# Altium schematic sheet Carte_Alim_2019_CAP.SchDoc
size A4; Author: Audran; CompanyName: Goldorak; Address1: Electrolab; Address2: 52 rue Paul Lescop; Address3: 92000 Nanterre; DocumentNumber: 4; SheetNumber: 4; SheetTotal: 5; ProjectName: Cartes_2017
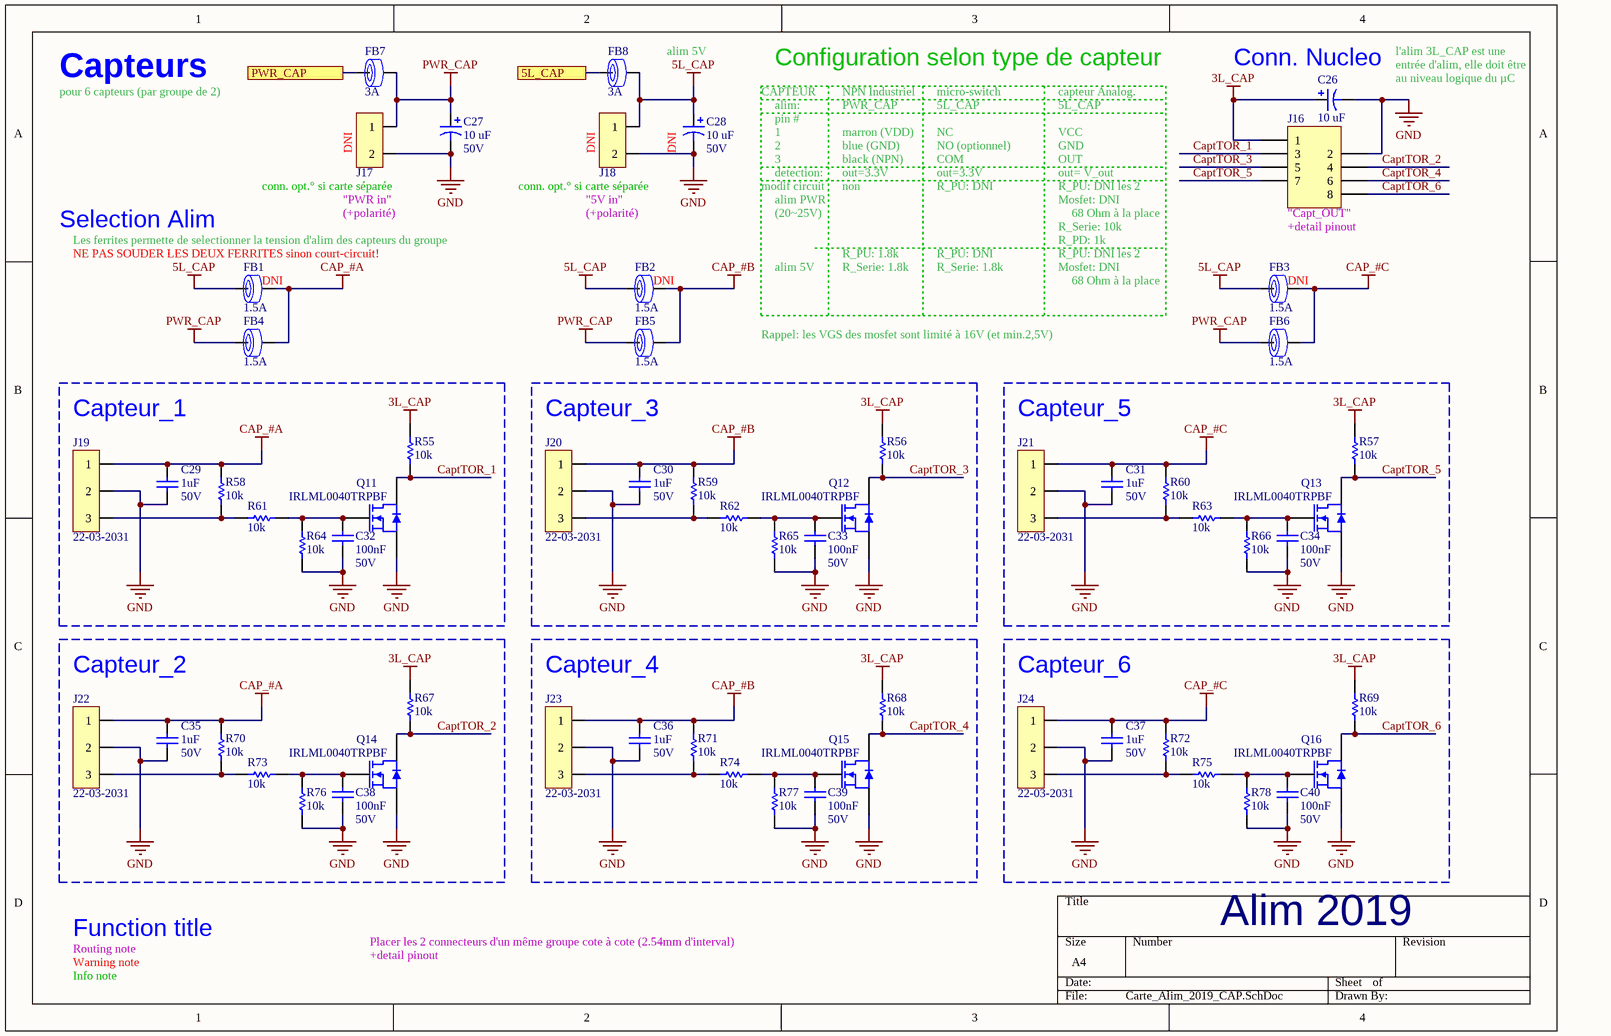
[diagram p0: Carte_Alim_2019_CAP.SchDoc]

## Parts
C26  10 uF  [WCAP-ATG8_5x11x2x0.5]
C27  10 uF  RatedVoltage: 50V  [WCAP-ATG8_5x11x2x0.5]
C28  10 uF  RatedVoltage: 50V  [WCAP-ATG8_5x11x2x0.5]
C29  1uF  RatedVoltage: 50V  [WCAP-CSGP_0805, 2x1.25x1.25]
C30  1uF  RatedVoltage: 50V  [WCAP-CSGP_0805, 2x1.25x1.25]
C31  1uF  RatedVoltage: 50V  [WCAP-CSGP_0805, 2x1.25x1.25]
C32  100nF  RatedVoltage: 50V  [WCAP-CSGP_0603, 1.6x0.8x0.8]
C33  100nF  RatedVoltage: 50V  [WCAP-CSGP_0603, 1.6x0.8x0.8]
C34  100nF  RatedVoltage: 50V  [WCAP-CSGP_0603, 1.6x0.8x0.8]
C35  1uF  RatedVoltage: 50V  [WCAP-CSGP_0805, 2x1.25x1.25]
C36  1uF  RatedVoltage: 50V  [WCAP-CSGP_0805, 2x1.25x1.25]
C37  1uF  RatedVoltage: 50V  [WCAP-CSGP_0805, 2x1.25x1.25]
C38  100nF  RatedVoltage: 50V  [WCAP-CSGP_0603, 1.6x0.8x0.8]
C39  100nF  RatedVoltage: 50V  [WCAP-CSGP_0603, 1.6x0.8x0.8]
C40  100nF  RatedVoltage: 50V  [WCAP-CSGP_0603, 1.6x0.8x0.8]
FB1  RatedCurrent: 1.5A  [WE-CBF_0603_High Current]  (hidden comment: 742792624)
FB2  RatedCurrent: 1.5A  [WE-CBF_0603_High Current]  (hidden comment: 742792624)
FB3  RatedCurrent: 1.5A  [WE-CBF_0603_High Current]  (hidden comment: 742792624)
FB4  RatedCurrent: 1.5A  [WE-CBF_0603_High Current]  (hidden comment: 742792624)
FB5  RatedCurrent: 1.5A  [WE-CBF_0603_High Current]  (hidden comment: 742792624)
FB6  RatedCurrent: 1.5A  [WE-CBF_0603_High Current]  (hidden comment: 742792624)
FB7  RatedCurrent: 3A  [WE-CBF_0805_High Current]  (hidden comment: 742792023)
FB8  RatedCurrent: 3A  [WE-CBF_0805_High Current]  (hidden comment: 742792023)
J16  690367280876  [690367280876]  (value not drawn)
J17  22-03-2021  [22-03-2021]  (value not drawn)
J18  22-03-2021  [22-03-2021]  (value not drawn)
J19  22-03-2031  [22-03-2031]
J20  22-03-2031  [22-03-2031]
J21  22-03-2031  [22-03-2031]
J22  22-03-2031  [22-03-2031]
J23  22-03-2031  [22-03-2031]
J24  22-03-2031  [22-03-2031]
Q11  IRLML0040TRPBF  [SOT-23]
Q12  IRLML0040TRPBF  [SOT-23]
Q13  IRLML0040TRPBF  [SOT-23]
Q14  IRLML0040TRPBF  [SOT-23]
Q15  IRLML0040TRPBF  [SOT-23]
Q16  IRLML0040TRPBF  [SOT-23]
R55  value 10k  [RESC1608X06N]  (hidden comment: RC0603FR-0710KL)
R56  value 10k  [RESC1608X06N]  (hidden comment: RC0603FR-0710KL)
R57  value 10k  [RESC1608X06N]  (hidden comment: RC0603FR-0710KL)
R58  value 10k  [RESC1608X06N]  (hidden comment: RC0603FR-0710KL)
R59  value 10k  [RESC1608X06N]  (hidden comment: RC0603FR-0710KL)
R60  value 10k  [RESC1608X06N]  (hidden comment: RC0603FR-0710KL)
R61  value 10k  [RESC1608X06N]  (hidden comment: RC0603FR-0710KL)
R62  value 10k  [RESC1608X06N]  (hidden comment: RC0603FR-0710KL)
R63  value 10k  [RESC1608X06N]  (hidden comment: RC0603FR-0710KL)
R64  value 10k  [RESC1608X06N]  (hidden comment: RC0603FR-0710KL)
R65  value 10k  [RESC1608X06N]  (hidden comment: RC0603FR-0710KL)
R66  value 10k  [RESC1608X06N]  (hidden comment: RC0603FR-0710KL)
R67  value 10k  [RESC1608X06N]  (hidden comment: RC0603FR-0710KL)
R68  value 10k  [RESC1608X06N]  (hidden comment: RC0603FR-0710KL)
R69  value 10k  [RESC1608X06N]  (hidden comment: RC0603FR-0710KL)
R70  value 10k  [RESC1608X06N]  (hidden comment: RC0603FR-0710KL)
R71  value 10k  [RESC1608X06N]  (hidden comment: RC0603FR-0710KL)
R72  value 10k  [RESC1608X06N]  (hidden comment: RC0603FR-0710KL)
R73  value 10k  [RESC1608X06N]  (hidden comment: RC0603FR-0710KL)
R74  value 10k  [RESC1608X06N]  (hidden comment: RC0603FR-0710KL)
R75  value 10k  [RESC1608X06N]  (hidden comment: RC0603FR-0710KL)
R76  value 10k  [RESC1608X06N]  (hidden comment: RC0603FR-0710KL)
R77  value 10k  [RESC1608X06N]  (hidden comment: RC0603FR-0710KL)
R78  value 10k  [RESC1608X06N]  (hidden comment: RC0603FR-0710KL)

## Blocks framed on the sheet
Capteur_1: C29 C32 J19 Q11 R55 R58 R61 R64
Capteur_3: C30 C33 J20 Q12 R56 R59 R62 R65
Capteur_5: C31 C34 J21 Q13 R57 R60 R63 R66
Capteur_2: C35 C38 J22 Q14 R67 R70 R73 R76
Capteur_4: C36 C39 J23 Q15 R68 R71 R74 R77
Capteur_6: C37 C40 J24 Q16 R69 R72 R75 R78

## Ports
5L_CAP, PWR_CAP

## Nets
3L_CAP: C26.1 J16.1 R55.2 R56.2 R57.2 R67.2 R68.2 R69.2
5L_CAP: C28.1 FB1.1 FB2.1 FB3.1 FB8.2 J18.1
CAP_#A: C29.2 C35.2 FB1.2 FB4.2 J19.1 J22.1 R58.2 R70.2
CAP_#B: C30.2 C36.2 FB2.2 FB5.2 J20.1 J23.1 R59.2 R71.2
CAP_#C: C31.2 C37.2 FB3.2 FB6.2 J21.1 J24.1 R60.2 R72.2
GND: C26.2 C27.2 C28.2 C29.1 C30.1 C31.1 C32.2 C33.2 C34.2 C35.1 C36.1 C37.1 C38.2 C39.2 C40.2 J16.2 J17.2 J18.2 J19.2 J20.2 J21.2 J22.2 J23.2 J24.2 Q11.2(S) Q12.2(S) Q13.2(S) Q14.2(S) Q15.2(S) Q16.2(S) R64.1 R65.1 R66.1 R76.1 R77.1 R78.1
PWR_CAP: C27.1 FB4.1 FB5.1 FB6.1 FB7.2 J17.1
5L_CAP: FB8.1 ; port 5L_CAP  [a separate net that carries the same name]
CaptTOR_1: J16.3 Q11.3(D) R55.1
CaptTOR_2: J16.4 Q14.3(D) R67.1
CaptTOR_3: J16.5 Q12.3(D) R56.1
CaptTOR_4: J16.6 Q15.3(D) R68.1
CaptTOR_5: J16.7 Q13.3(D) R57.1
CaptTOR_6: J16.8 Q16.3(D) R69.1
PWR_CAP: FB7.1 ; port PWR_CAP  [a separate net that carries the same name]
NetC32_1: C32.1 Q11.1(G) R61.2 R64.2
NetC33_1: C33.1 Q12.1(G) R62.2 R65.2
NetC34_1: C34.1 Q13.1(G) R63.2 R66.2
NetC38_1: C38.1 Q14.1(G) R73.2 R76.2
NetC39_1: C39.1 Q15.1(G) R74.2 R77.2
NetC40_1: C40.1 Q16.1(G) R75.2 R78.2
NetJ19_3: J19.3 R58.1 R61.1
NetJ20_3: J20.3 R59.1 R62.1
NetJ21_3: J21.3 R60.1 R63.1
NetJ22_3: J22.3 R70.1 R73.1
NetJ23_3: J23.3 R71.1 R74.1
NetJ24_3: J24.3 R72.1 R75.1

## Notes on the sheet
- Capteurs
- pour 6 capteurs (par groupe de 2)
- alim 5V
- CAPTEUR
- alim:
- Configuration selon type de capteur
- NPN Industriel
- PWR_CAP
- micro-switch
- 5L_CAP
- capteur Analog.
- (near C26) Conn. Nucleo
- l'alim 3L_CAP est une
- au niveau logique du µC
- entrée d'alim, elle doit être
- (near J17) DNI
- (near J18) DNI
- (near C28) DNI
- pin #
- 1
- 2
- 3
- detection:
- marron (VDD)
- blue (GND)
- black (NPN)
- out=3.3V
- NC
- NO (optionnel)
- COM
- VCC
- OUT
- GND
- out= V_out
- Selection Alim
- (near FB1) Les ferrites permette de selectionner la tension d'alim des capteurs du groupe
- (near J17) conn. opt.° si carte séparée
- (near J17) "PWR in"
- (+polarité)
- conn. opt.° si carte séparée
- (near J18) "5V in"
- modif circuit
- alim PWR
- (20~25V)
- non
- R_PU: DNI
- R_PU: DNI les 2
- Mosfet: DNI
- R_Serie: 10k
- R_PD: 1k
- 68 Ohm à la place
- (near J16) "Capt_OUT"
- (near J16) +detail pinout
- (near FB1) NE PAS SOUDER LES DEUX FERRITES sinon court-circuit!
- (near FB1) DNI
- (near FB2) DNI
- R_PU: 1.8k
- R_Serie: 1.8k
- (near FB3) DNI
- Rappel: les VGS des mosfet sont limité à 16V (et min.2,5V)
- Routing note
- Warning note
- Info note
- Function title
- Placer les 2 connecteurs d'un même groupe cote à cote (2.54mm d'interval)
- +detail pinout
- Alim 2019

## Library data of the parts
C26 = WCAP-ATG8, 860010672009: CAP Alu 10 UF 20% 50 V; Manufacturer: Wurth Elektronik; RatedVoltage: 50V; PublishedDate: July 2016; ComponentLink1Description: Manufacturer; ComponentLink1URL: http://www.we-online.de; ComponentLink2Description: Datasheet; ComponentLink2URL: http://katalog.we-online.de/pbs/datasheet/860010672009.pdf; Value: 10 uF; Size: 5mmx11mm; Manufacturer Part Number: 860010672009
C27 C28 = WCAP-ATG8, 860010672009: CAP Alu 10 UF 20% 50 V; Manufacturer: Wurth Elektronik; PublishedDate: July 2016; ComponentLink1Description: Manufacturer; ComponentLink1URL: http://www.we-online.de; ComponentLink2Description: Datasheet; ComponentLink2URL: http://katalog.we-online.de/pbs/datasheet/860010672009.pdf; Value: 10 uF; Size: 5mmx11mm; Manufacturer Part Number: 860010672009
C29-C31 C35-C37 = WCAP-CSGP, 885012207103: CAP CER 1uF 50V X7R 0805; Manufacturer: Wurth Elektronik; PublishedDate: Aug 2016; ComponentLink1Description: Manufacturer; ComponentLink1URL: http://www.we-online.de; ComponentLink2Description: Datasheet; ComponentLink2URL: http://katalog.we-online.com/pbs/datasheet/885012207103.pdf; Manufacturer Part Number: 885012207103; Value: 1uF; Size: 0805; CeramicType: X7R
C32-C34 C38-C40 = WCAP-CSGP, 885012206095: CAP CER 100nF 50V X7R 0603; Manufacturer: Wurth Elektronik; PublishedDate: Aug 2016; ComponentLink1Description: Manufacturer; ComponentLink1URL: http://www.we-online.de; ComponentLink2Description: Datasheet; ComponentLink2URL: http://katalog.we-online.com/pbs/datasheet/885012206095.pdf; Value: 100nF; Size: 0603; CeramicType: X7R; Manufacturer Part Number: 885012206095
FB1-FB6 = WE-CBF, 742792624: Ferrite Bead 180ohm 0603 max1.5A; Manufacturer: Wurth Elektronik; Value: 180Ω; Type: High Current; PublishedDate: Aug 2016; ComponentLink1Description: Manufacturer; ComponentLink1URL: http://www.we-online.de; ComponentLink2Description: Datasheet; ComponentLink2URL: http://katalog.we-online.de/pbs/datasheet/742792624.pdf; Manufacturer Part Number: 742792624; Size: 0603
FB7 FB8 = WE-CBF, 742792023: Ferrite Bead 120ohm 0805 3A; Manufacturer: Wurth Elektronik; Value: 120Ω; ComponentLink1Description: Manufacturer; ComponentLink1URL: https://www.we-online.com/catalog/en/WE-CBF/?sq=742792023#742792023; ComponentLink2Description: Datasheet; ComponentLink2URL: https://www.we-online.com/catalog/datasheet/742792023.pdf; Manufacturer Part Number: 742792023; Supplier 2: JLCPCB; Supplier Part Number 2: C1015; Supplier 1: Farnell; Supplier Part Number 1: 1635732
J16 = 690367280876: WR-MM 8p Female SMT Connector with Polarization; Manufacturer: Wurth Electronics Inc.; Value: 8; Manufacturer Part Number: 690367280876; ComponentLink1Description: Datasheet; ComponentLink1URL: http://katalog.we-online.de/em/datasheet/69036728xx76.pdf; Supplier 1: Farnell; Supplier Part Number 1: 1641850
J17 J18 = 22-03-2021: Manufacturer 1: MOLEX; Supplier 1: Farnell; Supplier Part Number 1: 9731075; Manufacturer Part Number: 22-03-2021; Pricing: 10=0.189, 100=0.147, 200=0.119, 500=0.108, 1000=0.088, 2500=0.08, 2500=0.0711, 20000=0.064 (EUR); ComponentLink1URL: http://www.farnell.com/cad/1533907.pdf; ComponentLink1Description: http://www.farnell.com/cad/1533907.pdf; ComponentLink2URL: http://www.farnell.com/datasheets/1791308.pdf; ComponentLink2Description: http://www.farnell.com/datasheets/1791308.pdf
J19-J24 = 22-03-2031: Manufacturer 1: MOLEX; Supplier 1: Farnell; Supplier Part Number 1: 9731083; Manufacturer Part Number: 22-03-2031; Pricing: 10=0.27, 100=0.242, 200=0.22, 500=0.208, 1000=0.202, 2500=0.196 (EUR); ComponentLink1URL: http://www.farnell.com/cad/1533907.pdf; ComponentLink1Description: http://www.farnell.com/cad/1533907.pdf; ComponentLink2URL: http://www.farnell.com/datasheets/1785732.pdf; ComponentLink2Description: http://www.farnell.com/datasheets/1785732.pdf
Q11-Q16 = IRLML0040: MOSFET N 40V 3.6A SOT23; Manufacturer: INTERNATIONAL RECTIFIER; Supplier 1: Farnell; Supplier Part Number 1: 1831088; Manufacturer Part Number: IRLML0040TRPBF; ComponentLink1Description: http://www.irf.com/product-info/datasheets/data/irlml0040pbf.pdf; ComponentLink1URL: http://www.irf.com/product-info/datasheets/data/irlml0040pbf.pdf
R55-R78 = RC0603FR-0710KL: RES SMD 10K OHM 1% 1/10W 0603; Manufacturer: Yageo; Power: 100mW; Vmax: 50V; Manufacturer Part Number: RC0603FR-0710KL; Type: Thick Film; ComponentLink1Description: Manufacturer; ComponentLink1URL: http://www.yageo.com/NewPortal/_en/index.jsp; ComponentLink2Description: Datasheet; ComponentLink2URL: http://www.farnell.com/datasheets/2167052.pdf; Supplier 1: Farnell; Supplier Part Number 1: 9238603; Precision: ±1%